# Altium schematic sheet Power.SchDoc
size A4
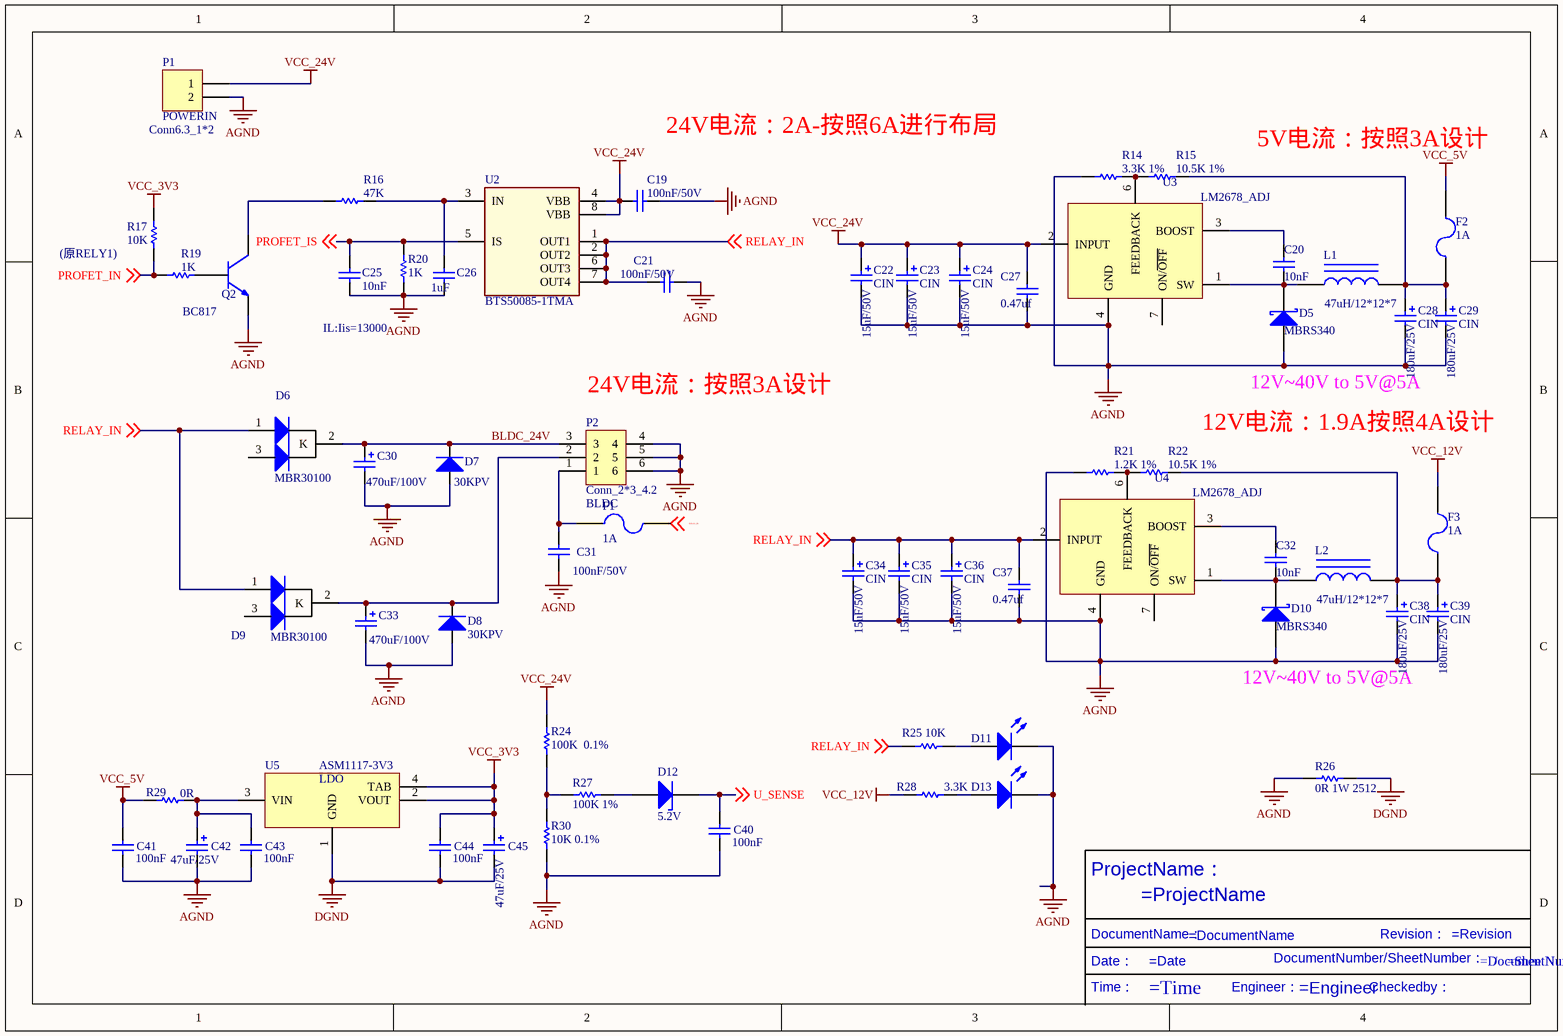
[diagram p0: Power.SchDoc]

## Parts
C19  value 100nF/50V  [C0805]  (hidden comment: Cap)
C20  value 10nF  [C0805]  (hidden comment: Cap)
C21  value 100nF/50V  [C0805]  (hidden comment: Cap)
C22  CIN  value 15uF/50V  [CAP-7343]
C23  CIN  value 15uF/50V  [CAP-7343]
C24  CIN  value 15uF/50V  [CAP-7343]
C25  value 10nF  [C0805]  (hidden comment: Cap)
C26  value 1uF  [C0805]  (hidden comment: Cap)
C27  value 0.47uf  [C0805]  (hidden comment: Cap)
C28  CIN  value 180uF/25V  [CAP-7343]
C29  CIN  value 180uF/25V  [CAP-7343]
C30  value 470uF/100V  [CTH-R9-D7]  (hidden comment: Cap Pol1)
C31  value 100nF/50V  [C0805]  (hidden comment: Cap)
C32  value 10nF  [C0805]  (hidden comment: Cap)
C33  value 470uF/100V  [CTH-R9-D7]  (hidden comment: Cap Pol1)
C34  CIN  value 15uF/50V  [CAP-7343]
C35  CIN  value 15uF/50V  [CAP-7343]
C36  CIN  value 15uF/50V  [CAP-7343]
C37  value 0.47uf  [C0805]  (hidden comment: Cap)
C38  CIN  value 180uF/25V  [CAP-7343]
C39  CIN  value 180uF/25V  [CAP-7343]
C40  value 100nF  [C0805]  (hidden comment: Cap)
C41  value 100nF  [C0805]  (hidden comment: Cap)
C42  value 47uF/25V  [CAP-1206]  (hidden comment: Cap Pol1)
C43  value 100nF  [C0805]  (hidden comment: Cap)
C44  value 100nF  [C0805]  (hidden comment: Cap)
C45  value 47uF/25V  [CAP-1206]  (hidden comment: Cap Pol1)
D5  value MBRS340  [DIODE-SMC]  (hidden comment: D Schottky)
D6  MBR30100  [TO-263-3]
D7  Type: 30KPV  [DIODE]  (hidden comment: TVS)
D8  Type: 30KPV  [DIODE]  (hidden comment: TVS)
D9  MBR30100  [TO-263-3]
D10  value MBRS340  [DIODE-SMC]  (hidden comment: D Schottky)
D11  LED0  [LED_0805]  (value not drawn)
D12  value 5.2V  [DIODE-1206]  (hidden comment: Diode-Z)
D13  LED0  [LED_0805]  (value not drawn)
F1  value 1A  [1812]  (hidden comment: Fuse)
F2  value 1A  [1812]  (hidden comment: Fuse)
F3  value 1A  [1812]  (hidden comment: Fuse)
L1  value 47uH/12*12*7  [L-SMD-12]  (hidden comment: Inductor Iron)
L2  value 47uH/12*12*7  [L-SMD-12]  (hidden comment: Inductor Iron)
P1  POWERIN  [DIP2*6.3]
P2  Conn_2*3_4.2  Conn4.2: BLDC  [PIN2X3_4.2]
Q2  BC817  [SOT-23_N]
R14  value 3.3K 1%  [R0805]  (hidden comment: Res1)
R15  value 10.5K 1%  [R0805]  (hidden comment: Res1)
R16  value 47K  [R0805]  (hidden comment: Res1)
R17  value 10K  [R0805]  (hidden comment: Res1)
R19  value 1K  [R0805]  (hidden comment: Res1)
R20  value 1K  [R0805]  (hidden comment: Res1)
R21  value 1.2K 1%  [R0805]  (hidden comment: Res1)
R22  value 10.5K 1%  [R0805]  (hidden comment: Res1)
R24  value 100K  0.1%  [R0805]  (hidden comment: Res1)
R25  value 10K  [R0805]  (hidden comment: Res1)
R26  value 0R 1W 2512  [2512]  (hidden comment: Res1)
R27  value 100K 1%  [R0805]  (hidden comment: Res1)
R28  value 3.3K  [R0805]  (hidden comment: Res1)
R29  value 0R  [R0805]  (hidden comment: Res1)
R30  value 10K 0.1%  [R0805]  (hidden comment: Res1)
U2  BTS50085-1TMA  [TO127P1385X450-8N-V]
U3  LM2678_ADJ  [TO-263-7]
U4  LM2678_ADJ  [TO-263-7]
U5  ASM1117-3V3  [ASM1117-3V3]

## Nets
AGND: C19.1 C21.1 C22.2 C23.2 C24.2 C25.2 C26.2 C27.1 C28.2 C29.2 C30.2 C31.2 C33.2 C34.2 C35.2 C36.2 C37.1 C38.2 C39.2 C40.1 C41.1 C42.2 C43.1 D5.1(A) D7.1(A) D8.1(A) D10.1(A) D11.2(K) D13.2(K) P1.2 P2.4 P2.5 P2.6 Q2.2(E) R14.1 R20.1 R21.1 R26.1 R30.2 U3.4(GND) U4.4(GND)
DGND: C44.1 C45.2 R26.2 U5.1(GND)
VCC_3V3: C44.2 C45.1 R17.1 U5.2(VOUT) U5.4(TAB)
VCC_5V: C41.2 F2.2 R29.1
VCC_12V: F3.2 R28.2
VCC_24V: C19.2 C22.1 C23.1 C24.1 C27.2 P1.1 R24.1 U2.4(VBB) U2.8(VBB) U3.2(INPUT)
BLDC_24V: C30.1 D6.2(K) D7.2(K) P2.3
PROFET_IN: R17.2 R19.2 ; off-sheet PROFET_IN
PROFET_IS: C25.1 R20.2 U2.5(IS) ; off-sheet PROFET_IS
RELAY_IN: C21.2 C34.1 C35.1 C36.1 C37.2 D6.1(A) D9.1(A) F1.2 R25.2 U2.1(OUT1) U2.2(OUT2) U2.6(OUT3) U2.7(OUT4) U4.2(INPUT) ; off-sheet RELAY_IN
U_SENSE: C40.2 D12.2(K) ; off-sheet U_SENSE
NetC20_1: C20.1 D5.2(K) L1.1 U3.1(SW)
NetC20_2: C20.2 U3.3(BOOST)
NetC26_1: C26.1 R16.2 U2.3(IN)
NetC28_1: C28.1 C29.1 F2.1 L1.2 R15.2
NetC31_1: C31.1 F1.1 P2.1
NetC32_1: C32.1 D10.2(K) L2.1 U4.1(SW)
NetC32_2: C32.2 U4.3(BOOST)
NetC33_1: C33.1 D8.2(K) D9.2(K) P2.2
NetC38_1: C38.1 C39.1 F3.1 L2.2 R22.2
NetC42_1: C42.1 C43.2 R29.2 U5.3(VIN)
NetD11_1: D11.1(A) R25.1
NetD12_1: D12.1(A) R27.2
NetD13_1: D13.1(A) R28.1
NetQ2_1: Q2.1(B) R19.1
NetQ2_3: Q2.3(C) R16.1
NetR14_2: R14.2 R15.1 U3.6(FEEDBACK)
NetR21_2: R21.2 R22.1 U4.6(FEEDBACK)
NetR24_2: R24.2 R27.1 R30.1

Not connected (* = marked no-connect by the designer): D6 3(A); D9 3(A); U3 7(ON/~{OFF}); U4 7(ON/~{OFF})

## Notes on the sheet
- (near P1) Conn6.3_1*2
- 24V电流：2A-按照6A进行布局
- 5V电流：按照3A设计
- (原RELY1)
- IL:Iis=13000
- (near P2) 24V电流：按照3A设计
- 12V电流：1.9A按照4A设计
- 12V~40V to 5V@5A
- Labels drawn without touching a wire or pin: /, =Date, =DocumentName, =DocumentNumber, =Engineer, =ProjectName, =Revision, =SheetNumber, =Time, Checkedby：, Date：, DocumentName：, DocumentNumber/SheetNumber：, Engineer：, ProjectName：, Revision：, Time：

## Library data of the parts
C19-C21 C25 C26 C31 C32 C40 C41 C43 C44 = Cap: Capacitor; Published: 8-Jun-2000; LatestRevisionDate: 17-Jul-2002; LatestRevisionNote: Re-released for DXP Platform.; PackageReference: RAD-0.3; Publisher: Altium Limited; PackageDescription: Radial Cap, Thru-Hole; 2 Leads; 0.3 in Pin Spacing
C22-C24 C28-C30 C33-C36 C38 C39 C42 C45 = Cap Pol1: Polarized Capacitor (Radial); Published: 8-Jun-2000; LatestRevisionDate: 17-Jul-2002; LatestRevisionNote: Re-released for DXP Platform.; PackageReference: RB7.6-15; Publisher: Altium Limited; PackageDescription: Polarized Capacitor (Radial); 2 Leads
C27 C37 = Cap: CC; Published: 8-Jun-2000; LatestRevisionDate: 17-Jul-2002; LatestRevisionNote: Re-released for DXP Platform.; PackageReference: RAD-0.3; Publisher: Altium Limited; PackageDescription: Radial Cap, Thru-Hole; 2 Leads; 0.3 in Pin Spacing
D5 D10 = D Schottky: Schottky Diode; Published: 8-Jun-2000; LatestRevisionDate: 17-Jul-2002; LatestRevisionNote: Re-released for DXP Platform.; PackageReference: SMB; Code_JEDEC: DO-214-AA
D6 D9 = MBR30100: Dual Diode; Published: 8-Jun-2000; LatestRevisionDate: 17-Jul-2002; LatestRevisionNote: Re-released for DXP Platform.; PackageVersion: Sep-1996; PackageReference: SMC; Publisher: Altium Limited; PackageDescription: DO-214-AB/SMC; 2 C-Bend Leads; Body 7.9 x 5.9 mm, inc. leads (LxW); Code_JEDEC: DO-214-AB
D7 D8 = TVS: TVS保护; Published: 8-Jun-2000; LatestRevisionDate: 17-Jul-2002; LatestRevisionNote: Re-released for DXP Platform.; PackageDocument: Sep-1996; PackageReference: SMC; Publisher: Altium Limited; Code_JEDEC: DO-214-AB
D11 D13 = LED0: 发光二极管; Published: 8-Jun-2000; LatestRevisionDate: 08-Jul-2005; LatestRevisionNote: Mech Layer 1 removed.; PackageReference: LED-0; Publisher: Altium Limited
D12 = Diode-Z: 稳压二极管; Published: 8-Jun-2000; LatestRevisionDate: 17-Jul-2002; LatestRevisionNote: Re-released for DXP Platform.; PackageReference: SMB; Publisher: Altium Limited; Code_JEDEC: DO-214-AA
F1-F3 = Fuse 2: 保险丝; Published: 8-Jun-2000; LatestRevisionDate: 17-Jul-2002; LatestRevisionNote: Re-released for DXP Platform.; PackageReference: PIN-W2/E2.8; Publisher: Altium Limited
L1 L2 = Inductor Iron: Magnetic-Core Inductor; Published: 24-Mar-1999; LatestRevisionDate: 17-Jul-2002; LatestRevisionNote: Re-released for DXP Platform.; PackageReference: AXIAL-0.9; Publisher: Altium Limited; PackageDescription: Axial Device, Thru-Hole; 2 Leads; 0.9 in Pin Spacing
P1 = Header 2: Conn6.3_1*2
Q2 = mNPN: NPN 45V 功耗 310mW; Value: BC817
R14-R17 R19-R22 R24-R30 = Res1: Resistor; Published: 8-Jun-2000; LatestRevisionDate: 17-Jul-2002; LatestRevisionNote: Re-released for DXP Platform.; PackageReference: AXIAL-0.3; Publisher: Altium Limited; PackageDescription: Axial Device, Thru-Hole; 2 Leads; 0.3 in Pin Spacing
U2 = BTS50085-1TMA: Smart Highside High Current Power Switch, VBB 70V; Manufacturer: Infineon Technologies; ManufacturerPartNumber: BTS50085-1TMA; PackageReference: PG-TO220-7-4
U3 U4 = LM2678
U5 = LDO